# EAGLE design SMDBoard (EAGLE 9.6.2)
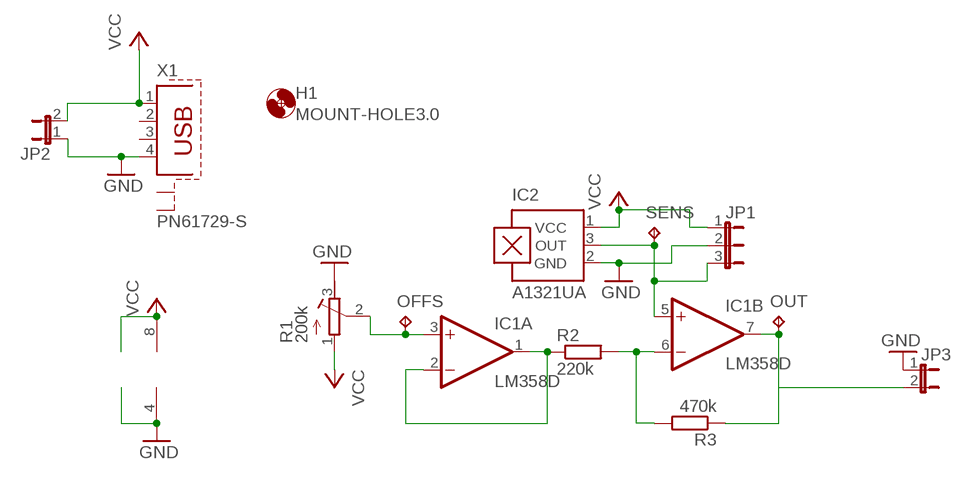
[diagram p0: schematic, sheet 1]

## Parts
H1  MOUNT-HOLE3.0  [3,0]
IC1  LM358D  [SO08]
IC2  A1321UA  [SIP3-UA]
JP1  JP2E  [JP2]
JP2  JP1E  [JP1]
JP3  JP1E  [JP1]
OFFS  TPB1,27  [B1,27]
OUT  TPB1,27  [B1,27]
R1  200k  R-TRIMM3296W  [RTRIM3296W]
R2  220k  R-EU_R0805  [R0805]
R3  470k  R-EU_R0805  [R0805]
SENS  TPB1,27  [B1,27]
X1  PN61729-S  [PN61729-S]

## Nets
GND [gnd]: IC1.4(P:V-) IC2.2(GND) JP1.2 JP2.1 JP3.1 R1.3(E) X1.4
N$1 [signal]: IC1.1(A:OUT) IC1.2(A:-IN) R2.1
N$2 [signal]: IC1.6(B:-IN) R2.2 R3.2
N$3 [signal]: IC1.7(B:OUT) JP3.2 OUT.TP R3.1
N$5 [signal]: IC1.5(B:+IN) IC2.3(OUT) JP1.3 SENS.TP
OFFS [signal]: IC1.3(A:+IN) OFFS.TP R1.2(S)
VCC [vcc]: IC1.8(P:V+) IC2.1(VCC) JP1.1 JP2.2 R1.1(A) X1.1
Unconnected: X1.2 X1.3 X1.S1 X1.S2

## Library data of the parts
H1 = holes:MOUNT-HOLE: MOUNTING HOLE with drill center marker
IC1 = linear:LM358: OP AMP also LM158; LM258; LM2904 Source: http://cache.national.com/ds/LM/LM158.pdf
IC2 = allegro:A13*?: Linear Hall Effect Sensor ICs Continuous-Time Ratiometric High-Temperature Operation Programmable Linear with Analog Output A1302 -Replacement- UGN3503 Source: http://www.allegromicro.com/en/Products/Part_Numbers/1301/1301.pdf http://www.allegromicro.com/en/Products/Part_Numbers/1321/1321.pdf http://www.allegromicro.com/en/Products/Part_Numbers/1381/1381.pdf; MF: ALLEGRO MICROSYSTEMS, INC.; MPN: A1321EUA-T; OC_FARNELL: 1521678; OC_NEWARK: 43K8768
JP1 = jumper:JP2E: JUMPER
JP2 JP3 = jumper:JP1E: JUMPER
OFFS OUT SENS = testpad:TP: Test pad
R1 = rcl:R-TRIMM: Trimm resistor; SPICEMODEL: X; SPICEPREFIXL: POT
R2 R3 = rcl:R-EU_: RESISTOR, European symbol; SPICEPREFIX: R
X1 = con-berg:PN61729-S: BERG USB connector; OC_FARNELL: unknown; OC_NEWARK: unknown

## Net classes
1 gnd: width 0.635 mm
2 vcc: width 0.635 mm
3 signal: width 0.381 mm

## Board
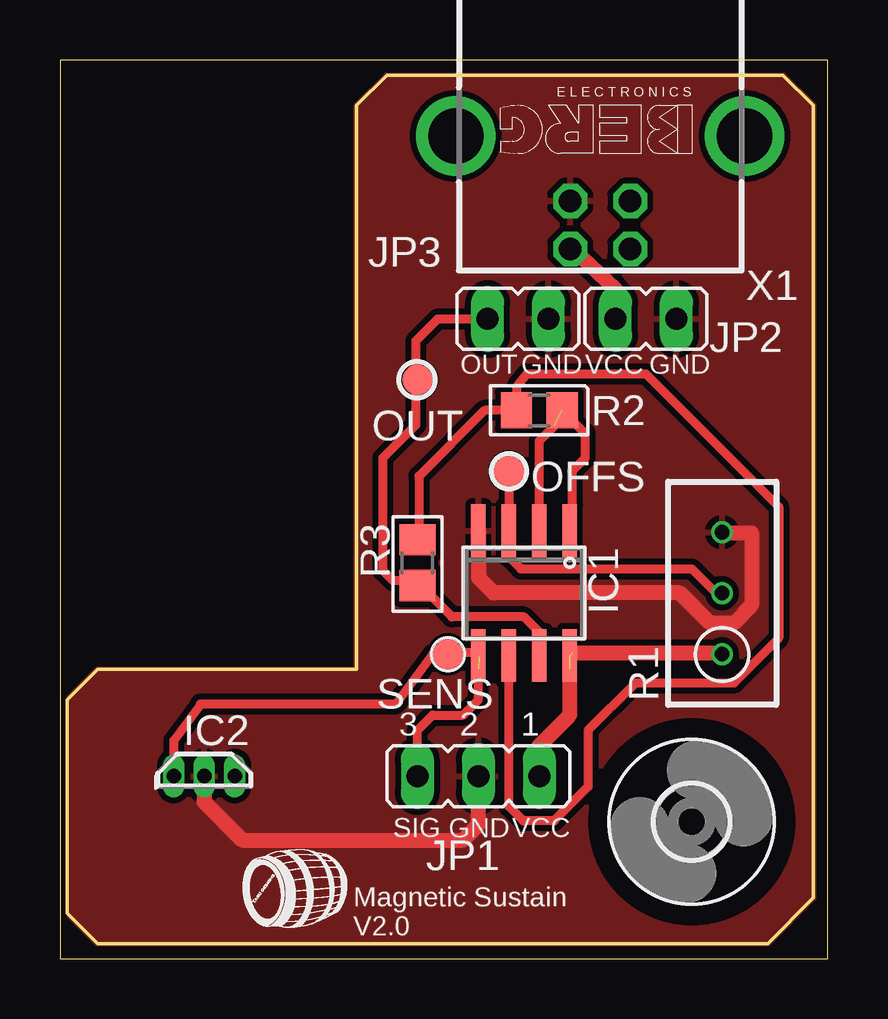
[diagram p1: board, top side]
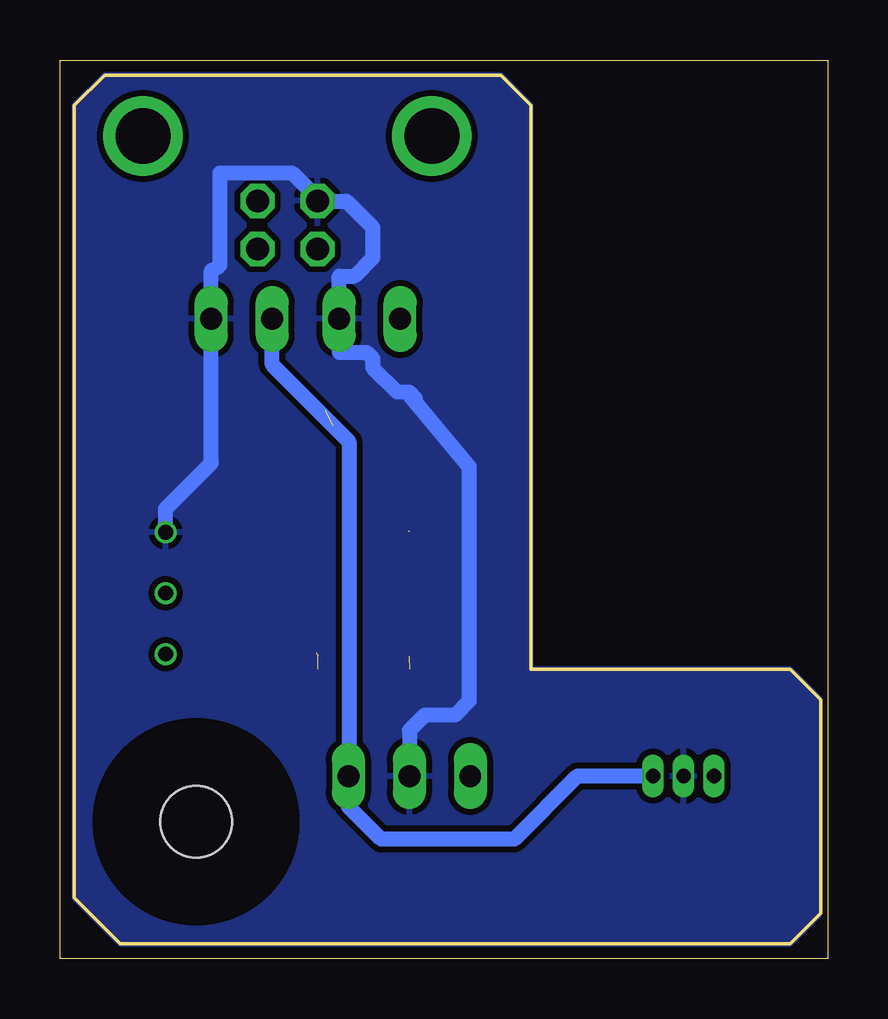
[diagram p2: board, bottom side, seen from below]

Size 32.01 x 37.45 mm. Coordinates in mm from the lower left corner, seen from the top.
Outline: 0,0 32.01,0 32.01,37.45 0,37.45 0,0
Copper layers (1*16): Top 0.035559375mm / dielectric 1.6mm / Bottom 0.035559375mm
Design rules "jlcpcb2layer": minimum track width 5mil, minimum drill 12mil, track to track 5mil, track to pad 5mil, pad to pad 5mil, via to via 5mil, smd to smd 5mil, copper to edge 8mil, drill to drill 6mil, minimum pad ring 5mil, minimum via ring 3mil, stop-mask expansion 2.5mil, vias tented up to drill 0mil, thermal gap 10mil
Milling: 11 lines

### Footprints (pad centres in the part's own frame; a part is rotated, then mirrored left to right if it is on the bottom)
3,0 = hole 3: 0,0
SO08 = smd 0.6 x 2.2: 1 -1.905,-2.6; 2 -0.635,-2.6; 3 0.635,-2.6; 4 1.905,-2.6; 5 1.905,2.6; 6 0.635,2.6; 7 -0.635,2.6; 8 -1.905,2.6
SIP3-UA = drill 0.6 pad 0.7 long: 1 -1.27,0; 2 0,0; 3 1.27,0
JP2 = drill 0.914 long: 1 -2.54,0; 2 0,0; 3 2.54,0
JP1 = drill 0.914 long: 1 0,-1.27; 2 0,1.27
B1,27 = smd 1.27 x 1.27: TP 0,0
RTRIM3296W = drill 0.61: 1 0,-2.54; 2 0,0; 3 0,2.54
R0805 = smd 1.3 x 1.5: 1 -0.95,0; 2 0.95,0
PN61729-S = drill 0.95 octagon: 1 1.25,4.71; 2 -1.25,4.71; 3 -1.25,2.71; 4 1.25,2.71 | drill 2.3 pad 2.9: S1 -6.02,0; S2 6.02,0

### Placement (x,y rotation side)
H1  26.34,5.72 0 top
IC1  19.35,15.24 180 top
IC2  6.01,7.62 180 top
JP1  17.45,7.62 180 top
JP2  24.43,26.67 90 top
JP3  19.1,26.67 90 top
OFFS  18.71,20.32 0 top
OUT  14.9,24.13 0 top
R1  27.61,15.24 0 top
R2  19.98,22.86 180 top
R3  14.9,16.51 90 top
SENS  16.18,12.7 90 top
X1  22.52,34.29 180 top

### Tracks (layer width: path | path; a pad name or v marks a point on that pad's centre or on a via)
GND  (1 unrouted)
  Top 0.635: 6.09,7.54 IC2.2 6.01,6.55 7.6,4.95 16.81,4.95 17.45,5.59 JP1.2 | 17.47,17.82 17.47,15.85 18.07,15.25 25.84,15.25 27.09,14 28.09,14 28.84,14.75 28.84,17.75 27.84,17.75 R1.3
  Bottom 0.635: R1.3 27.61,18.76 25.69,20.67 25.7,20.74 JP2.1 25.7,28.68 25.34,28.88 25.34,32.75 22.34,32.75 21.34,31.75 X1.4 20.07,31.58 18.97,30.48 18.97,29.21 19.73,28.45 20.37,28.45 JP3.1 20.37,25.27 19.22,25.27 18.97,25.02 18.97,24.64 17.95,23.62 17.45,23.62 17.19,23.37 17.32,23.37 17.45,23.49 14.95,20.51 14.95,10.75 15.54,10.16 16.81,10.16 17.45,9.52 JP1.2
  pour Bottom (isolate 0.25): 0.3,10.8 1.57,12.06 12.37,12.06 12.37,35.56 13.63,36.83 30.14,36.83 31.41,35.56 31.41,2.54 29.51,0.63 1.57,0.63 0.3,1.91
  pour Top (isolate 0.25): 0.3,10.8 1.57,12.06 12.37,12.06 12.37,35.56 13.63,36.83 30.14,36.83 31.41,35.56 31.41,2.54 29.51,0.63 1.57,0.63 0.3,1.91
N$1  (1 unrouted)
  Top 0.381: 21.34,22.75 R2.1 21.89,21.91 21.89,20.87 21.34,20.32 21.34,18.25 IC1.1 | IC1.2 19.98,19.51 | 19.98,19.51 19.98,19.52 | 19.98,19.51 19.98,21.59 20.62,22.23
N$2
  Top 0.381: R3.2 14.96,17.5 14.96,20.12 17.7,22.86 R2.2 19.04,23.83 19.46,24.38 24.44,24.38 29.97,18.85 29.97,13.37 28.09,11.5 23.99,11.5 22.02,9.52 22.02,7.17 20.59,5.75 19.32,5.75 18.71,6.35 18.71,12.52 IC1.6
N$3
  Top 0.381: IC1.7 19.97,12.65 19.97,13.62 19.34,14.25 16.34,14.25 15.34,15.25 R3.1 14.84,15.75 13.89,15.75 13.47,16.17 13.47,20.88 14.84,22.25 14.84,23.75 OUT.TP 14.84,24.25 14.84,25.75 15.76,26.67 JP3.2
N$5  (1 unrouted)
  Top 0.381: IC2.3 4.75,9.09 5.86,10.62 13.99,10.62 15.54,12.7 SENS.TP 16.34,12.75 17.34,12.75 IC1.5 17.47,12.62 | JP1.3 14.9,9.52 15.54,10.16 16.81,10.16 17.45,10.8 17.45,12.06
OFFS
  Top 0.381: OFFS.TP IC1.3 18.71,16.75 19.21,16.25 26.34,16.25 27.34,15.25 R1.2
VCC  (2 unrouted)
  Top 0.635: 21.34,12.75 27.34,12.75 R1.1 | X1.1 21.38,29.58 23.16,27.9 JP2.2 | JP1.1 19.98,8.89 21.25,10.16 21.25,12.06
  Bottom 0.635: IC2.1 7.3,7.63 10.43,7.63 13.07,4.99 18.62,4.99 19.98,6.35 JP1.1 19.96,7.65 19.96,21.56 23.16,24.76 JP2.2

### Text on the board
tNames: OUT | GND | VCC | GND | SIG | GND | VCC | Magnetic Sustain / V2.0